# Altium schematic sheet MIDI_FULL.SCHDOC: MIDI Sub-system
size A4; DocumentNumber: 42; SheetNumber: 43; SheetTotal: 78; PageSetup: Record=PageOptions|CenterHorizontal=True|CenterVertical=True|PrintScale=0.97|XCorrection=1.00|YCorrection=1.00|PrintKind=1|BorderSize=5000000|LeftOffset=0|BottomOffset=0|Orientation=2|PaperLength=1000|PaperWidth=1000|Scale=100|PaperSource=7|PrintQuality=-4|MediaType=1|DitherType=10|PaperKind=A4 (210 x 297 mm)|PrintScaleMode=1
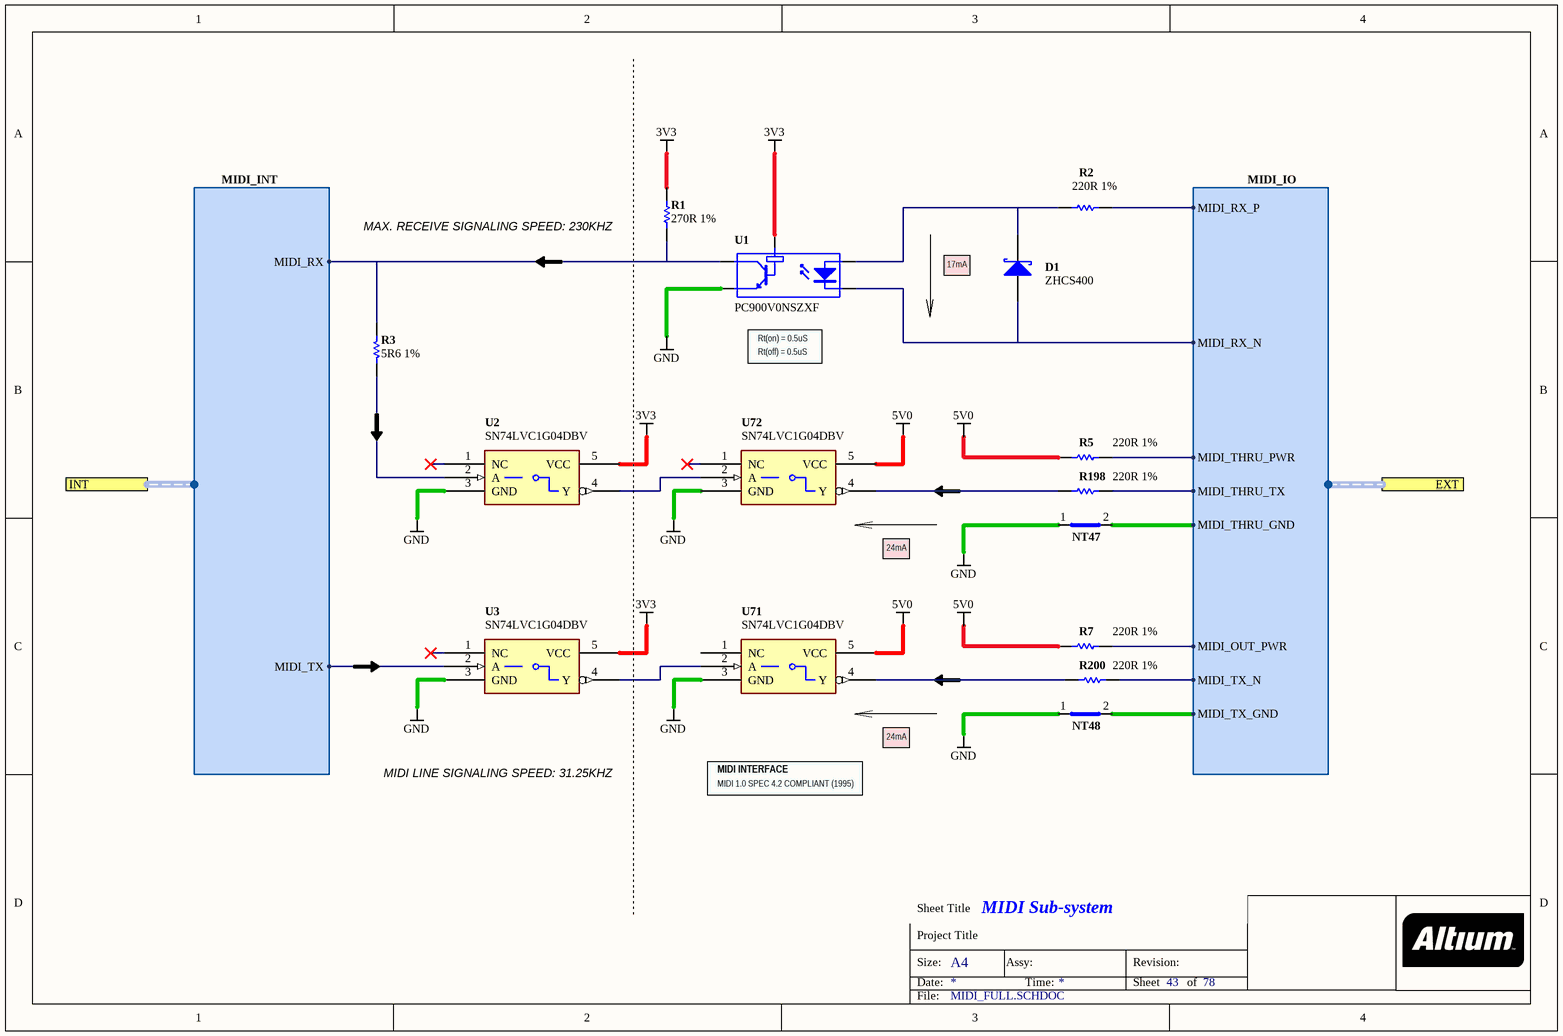
[diagram p0: MIDI_FULL.SCHDOC]

## Parts
D1  ZHCS400  [SOD323]
NT47  Net Tie SMT2  [NETTIE-SMT2-8X8]  (value not drawn)  (net tie, no BOM)
NT48  Net Tie SMT2  [NETTIE-SMT2-8X8]  (value not drawn)  (net tie, no BOM)
R1  270R 1%  [RESC1005-STAR]
R2  220R 1%  [RESC1005-STAR]
R3  5R6 1%  [RESC1005-STAR]
R5  220R 1%  [RESC1005-STAR]
R7  220R 1%  [RESC1005-STAR]
R198  220R 1%  [RESC1005-STAR]
R200  220R 1%  [RESC1005-STAR]
U1  PC900V0NSZXF  [H11L1SR2VM]
U2  SN74LVC1G04DBV  [SOT95P280-5]
U3  SN74LVC1G04DBV  [SOT95P280-5]
U71  SN74LVC1G04DBV  [SOT95P280-5]
U72  SN74LVC1G04DBV  [SOT95P280-5]

## Ports
EXT (harness MIDI_IO), INT (harness MIDI_INT)

## Harnesses
MIDI_IO: MIDI_RX_N, MIDI_RX_P, MIDI_THRU_TX, MIDI_TX_N, MIDI_OUT_PWR, MIDI_TX_GND, MIDI_THRU_GND, MIDI_THRU_PWR
MIDI_INT: MIDI_TX, MIDI_RX

## Nets
3V3: R1.2 U1.6(Vcc) U2.5(VCC) U3.5(VCC)
5V0: R5.1 R7.1 U71.5(VCC) U72.5(VCC)
GND: NT47.1(Net1) NT48.1(Net1) U1.5(GND) U2.3(GND) U3.3(GND) U71.3(GND) U72.3(GND)
NetD1_1: D1.1(A) U1.2(K) ; port EXT.MIDI_RX_N
NetD1_2: D1.2(K) R2.1 U1.1(A)
NetNT47_2: NT47.2(Net2) ; port EXT.MIDI_THRU_GND
NetNT48_2: NT48.2(Net2) ; port EXT.MIDI_TX_GND
NetR1_1: R1.1 R3.2 U1.4(Vo) ; port INT.MIDI_RX
NetR2_2: R2.2 ; port EXT.MIDI_RX_P
NetR3_1: R3.1 U2.2(A)
NetR5_2: R5.2 ; port EXT.MIDI_THRU_PWR
NetR7_2: R7.2 ; port EXT.MIDI_OUT_PWR
NetR198_1: R198.1 U72.4(Y)
NetR198_2: R198.2 ; port EXT.MIDI_THRU_TX
NetR200_1: R200.1 U71.4(Y)
NetR200_2: R200.2 ; port EXT.MIDI_TX_N
NetU2_4: U2.4(Y) U72.2(A)
NetU3_2: U3.2(A) ; port INT.MIDI_TX
NetU3_4: U3.4(Y) U71.2(A)

Not connected (* = marked no-connect by the designer): U2 1(NC)*; U3 1(NC)*; U71 1(NC); U72 1(NC)*

## Notes on the sheet
- MAX. RECEIVE SIGNALING SPEED: 230KHZ
- (near D1) 17mA
- (near U1) Rt(on) = 0.5uS
- Rt(off) = 0.5uS
- 24mA
- MIDI LINE SIGNALING SPEED: 31.25KHZ
- MIDI INTERFACE
- MIDI 1.0 SPEC 4.2 COMPLIANT (1995)
- Sheet Title
- Project Title
- Size:
- Date:
- A4
- Assy:
- Time:
- Revision:
- Sheet
- of
- File:

## Library data of the parts
D1 = D-151-0004: Schottky Diode, 400mA; Rated Voltage: mV; Max Forward Current: 400 mA; Mounting Technology: Surface Mount; Status: Unreleased; Category: Diode-Schottky
NT47 NT48 = D-002-0002: Net-Tie, Surface Mount, 2 x 0.4mm x 0.2mm SMT Pads - For 0.2mm Track; Status: Production; Category: Net-Tie
R1 = D-100-0111: Resistor, 270R 1% 0402 (1005); Power Rating: 63 mW; Category: Resistor; Mounting Technology: Surface Mount; Resistance: 270 R; Status: Production; Tolerance: 1 %
R2 R5 R7 R198 R200 = D-100-0115: Resistor, 220R 1% 0402 (1005); Power Rating: 63 mW; Category: Resistor; Mounting Technology: Surface Mount; Resistance: 220 R; Status: Production; Tolerance: 1 %
R3 = D-100-0085: Resistor, 5R6 1% 0402 (1005); Power Rating: 63 mW; Resistance: 5.6 R; Category: Resistor; Mounting Technology: Surface Mount; Status: Production; Tolerance: 1 %
U1 = D-152-0005: OPTOISOLATOR; SMD; Digital Output, Normal OFF  Operation; Transistor Type: NPN; Mounting Technology: Surface Mount; Status: Unreleased; Category: Transistor-Bipolar
U2 U3 U71 U72 = D-205-0001: SN74LVC1G04DBV, Single Inverter Gate, 1.65-V to 5.5-V; Mounting Technology: Surface Mount; Status: Production; Category: IC-Logic